# EAGLE design ME433-hw6-schematic (EAGLE 9.6.2)
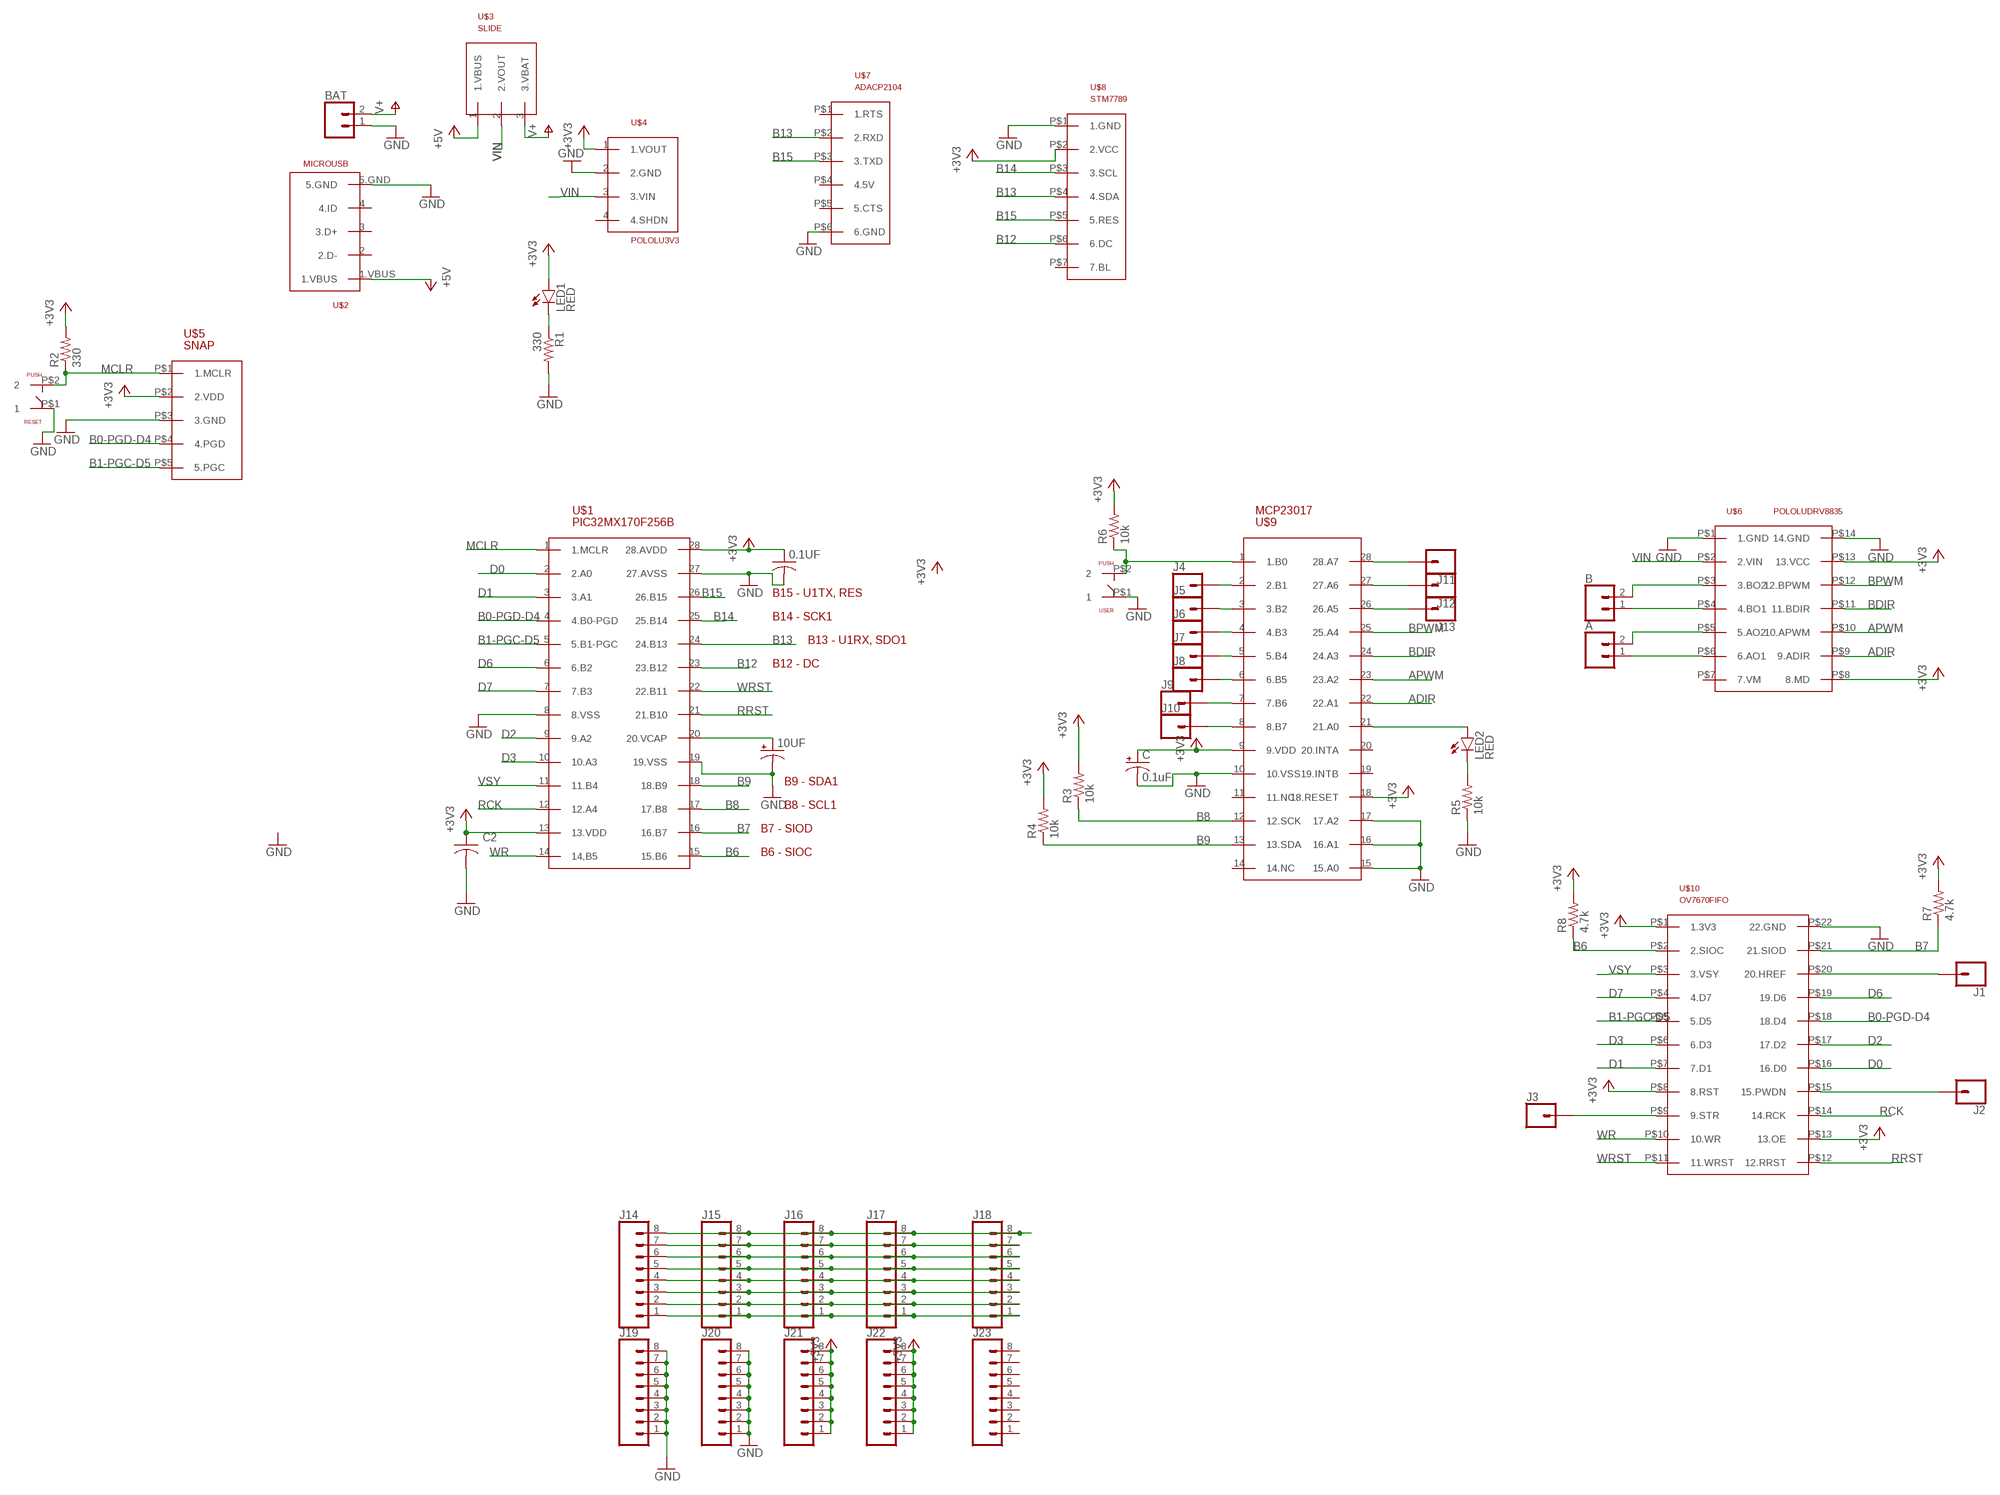
[diagram p0: schematic, sheet 1]

## Parts
0.1UF  C-US025-030X050  [C025-030X050]
10UF  CPOL-USB45181B  [B45181B]
A  CONN_02  [1X02]
B  CONN_02  [1X02]
BAT  CONN_02  [1X02]
C  0.1uF  CPOL-USB45181B  [B45181B]
C2  C-US025-030X050  [C025-030X050]
J1  CONN_01  [1X01]
J2  CONN_01  [1X01]
J3  CONN_01  [1X01]
J4  CONN_01  [1X01]
J5  CONN_01  [1X01]
J6  CONN_01  [1X01]
J7  CONN_01  [1X01]
J8  CONN_01  [1X01]
J9  CONN_01  [1X01]
J10  CONN_01  [1X01]
J11  CONN_01  [1X01]
J12  CONN_01  [1X01]
J13  CONN_01  [1X01]
J14  CONN_08"  [1X08]
J15  CONN_08"  [1X08]
J16  CONN_08"  [1X08]
J17  CONN_08"  [1X08]
J18  CONN_08"  [1X08]
J19  CONN_08"  [1X08]
J20  CONN_08"  [1X08]
J21  CONN_08"  [1X08]
J22  CONN_08"  [1X08]
J23  CONN_08"  [1X08]
LED1  RED  LED3MM  [LED3MM]
LED2  RED  LED3MM  [LED3MM]
R1  330  R-US_0207/10  [0207/10]
R2  330  R-US_0207/10  [0207/10]
R3  10k  R-US_0207/10  [0207/10]
R4  10k  R-US_0207/10  [0207/10]
R5  10k  R-US_0207/10  [0207/10]
R6  10k  R-US_0207/10  [0207/10]
R7  4.7k  R-US_0207/10  [0207/10]
R8  4.7k  R-US_0207/10  [0207/10]
RESET  PUSH  [PUSH]
U$1  PIC32MX170F256B  [DIL28-3]
U$2  MICROUSB  [MICROUSB]
U$3  SLIDE  [SLIDE]
U$4  POLOLU3V3  [POLOLU3V3]
U$5  SNAP  [SNAP]
U$6  POLOLUDRV8835  [POLOLUDRV8835]
U$7  ADACP2104  [ADACP2104]
U$8  STM7789  [STM7789]
U$9  MCP23017  [MCP23017]
U$10  OV7670FIFO  [OV7670FIFO]
USER  PUSH  [PUSH]

## Nets
+3V3: 0.1UF.1 C2.1 C.+ J21.1 J21.2 J21.3 J21.4 J21.5 J21.6 J21.7 J21.8 J22.1 J22.2 J22.3 J22.4 J22.5 J22.6 J22.7 J22.8 LED1.A R2.2 R3.2 R4.2 R6.2 R7.2 R8.2 U$1.13(13.VDD) U$1.28(28.AVDD) U$4.1(1.VOUT) U$5.P$2(2.VDD) U$6.P$8(8.MD) U$6.P$13(13.VCC) U$8.P$2(2.VCC) U$9.9(9.VDD) U$9.18(18.RESET) U$10.P$1(1.3V3) U$10.P$8(8.RST) U$10.P$13(13.OE)
+5V: U$2.1.VBUS U$3.1(1.VBUS)
ADIR: U$6.P$9(9.ADIR) U$9.22(22.A1)
APWM: U$6.P$10(10.APWM) U$9.23(23.A2)
B0-PGD-D4: U$1.4(4.B0-PGD) U$5.P$4(4.PGD) U$10.P$18(18.D4)
B1-PGC-D5: U$1.5(5.B1-PGC) U$5.P$5(5.PGC) U$10.P$5(5.D5)
B6: R8.1 U$1.15(15.B6) U$10.P$2(2.SIOC)
B7: R7.1 U$1.16(16.B7) U$10.P$21(21.SIOD)
B8: R3.1 U$1.17(17.B8) U$9.12(12.SCK)
B9: R4.1 U$1.18(18.B9) U$9.13(13.SDA)
B12: U$1.23(23.B12) U$8.P$6(6.DC)
B13: U$1.24(24.B13) U$7.P$2(2.RXD) U$8.P$4(4.SDA)
B14: U$1.25(25.B14) U$8.P$3(3.SCL)
B15: U$1.26(26.B15) U$7.P$3(3.TXD) U$8.P$5(5.RES)
BDIR: U$6.P$11(11.BDIR) U$9.24(24.A3)
BPWM: U$6.P$12(12.BPWM) U$9.25(25.A4)
D0: U$1.2(2.A0) U$10.P$16(16.D0)
D1: U$1.3(3.A1) U$10.P$7(7.D1)
D2: U$1.9(9.A2) U$10.P$17(17.D2)
D3: U$1.10(10.A3) U$10.P$6(6.D3)
D6: U$1.6(6.B2) U$10.P$19(19.D6)
D7: U$1.7(7.B3) U$10.P$4(4.D7)
GND: 0.1UF.2 10UF.- BAT.1 C2.2 C.- J19.1 J19.2 J19.3 J19.4 J19.5 J19.6 J19.7 J19.8 J20.1 J20.2 J20.3 J20.4 J20.5 J20.6 J20.7 J20.8 R1.2 R5.1 RESET.P$1 U$1.8(8.VSS) U$1.19(19.VSS) U$1.27(27.AVSS) U$2.5.GND U$4.2(2.GND) U$5.P$3(3.GND) U$6.P$1(1.GND) U$6.P$14(14.GND) U$7.P$6(6.GND) U$8.P$1(1.GND) U$9.10(10.VSS) U$9.15(15.A0) U$9.16(16.A1) U$9.17(17.A2) U$10.P$22(22.GND) USER.P$1
MCLR: R2.1 RESET.P$2 U$1.1(1.MCLR) U$5.P$1(1.MCLR)
N$1: LED1.K(C) R1.1
N$2: LED2.K(C) R5.2
N$3: B.2 U$6.P$3(3.BO2)
N$4: 10UF.+ U$1.20(20.VCAP)
N$5: LED2.A U$9.21(21.A0)
N$6: R6.1 U$9.1(1.B0) USER.P$2
N$7: B.1 U$6.P$4(4.BO1)
N$8: A.2 U$6.P$5(5.AO2)
N$9: A.1 U$6.P$6(6.AO1)
N$10: J3.1 U$10.P$9(9.STR)
N$11: J2.1 U$10.P$15(15.PWDN)
N$12: J1.1 U$10.P$20(20.HREF)
N$13: J4.1 U$9.2(2.B1)
N$14: J5.1 U$9.3(3.B2)
N$15: J6.1 U$9.4(4.B3)
N$16: J7.1 U$9.5(5.B4)
N$17: J8.1 U$9.6(6.B5)
N$18: J9.1 U$9.7(7.B6)
N$19: J10.1 U$9.8(8.B7)
N$20: J11.1 U$9.28(28.A7)
N$21: J12.1 U$9.27(27.A6)
N$22: J13.1 U$9.26(26.A5)
N$23: J14.8 J15.8 J16.8 J17.8 J18.8
N$24: J14.7 J15.7 J16.7 J17.7 J18.7
N$25: J14.6 J15.6 J16.6 J17.6 J18.6
N$26: J14.5 J15.5 J16.5 J17.5 J18.5
N$27: J14.4 J15.4 J16.4 J17.4 J18.4
N$28: J14.3 J15.3 J16.3 J17.3 J18.3
N$29: J14.2 J15.2 J16.2 J17.2 J18.2
N$30: J14.1 J15.1 J16.1 J17.1 J18.1
RCK: U$1.12(12.A4) U$10.P$14(14.RCK)
RRST: U$1.21(21.B10) U$10.P$12(12.RRST)
V+: BAT.2 U$3.3(3.VBAT)
VIN: U$3.2(2.VOUT) U$4.3(3.VIN) U$6.P$2(2.VIN)
VSY: U$1.11(11.B4) U$10.P$3(3.VSY)
WR: U$1.14(14,B5) U$10.P$10(10.WR)
WRST: U$1.22(22.B11) U$10.P$11(11.WRST)
Unconnected: J23.1 J23.2 J23.3 J23.4 J23.5 J23.6 J23.7 J23.8 U$2.2(2.D-) U$2.3(3.D+) U$2.4(4.ID) U$4.4(4.SHDN) U$6.P$7(7.VM) U$7.P$1(1.RTS) U$7.P$4(4.5V) U$7.P$5(5.CTS) U$8.P$7(7.BL) U$9.11(11.NC) U$9.14(14.NC) U$9.19(19.INTB) U$9.20(20.INTA)

## Notes on the sheet
- B15 - U1TX, RES
- B14 - SCK1
- B13 - U1RX, SDO1
- B12 - DC
- B9 - SDA1
- B8 - SCL1
- B7 - SIOD
- B6 - SIOC

## Library data of the parts
0.1UF C2 = ME433-PCB-Library:C-US: CAPACITOR, American symbol; SPICEPREFIX: C
10UF C = ME433-PCB-Library:CPOL-US: POLARIZED CAPACITOR, American symbol; SPICEPREFIX: C
A B BAT = ME433-PCB-Library:CONN_02: Multi connection point. Often used as Generic Header-pin footprint for 0.1 inch spaced/style header connections On any of the 0.1 inch spaced packages, you can populate with these: Break Away Headers - Straight <https://www.sparkfun.com/products/116> (PRT-00116) Break Away Male Headers - Right Angle <https://www.sparkfun.com/products/553> (PRT-00553) Female Headers <https://www.sparkfun.com/products/115> (PRT-00115) Break Away Headers - Machine Pin <https://www.sparkfun.com/products/117> (PRT-00117) Break Away Female Headers - Swiss Machine Pin <https://www.sparkfun.com/products/743> (PRT-00743) For SCREWTERMINALS and SPRING TERMINALS visit here: Screw Terimnals on SparkFun.com <https://www.sparkfun.com/search/results?term=Screw+Terminals> (5mm/3.5mm/2.54mm spacing) This device is also useful as a general connection point to wire up your design to another part of your project. Our various solder wires solder well into these plated through hole pads. Hook-Up Wire - Assortment (Stranded, 22 AWG) <https://www.sparkfun.com/products/11375> (PRT-11375) Hook-Up Wire - Assortment (Solid Core, 22 AWG) <https://www.sparkfun.com/products/11367> (PRT-11367) View the entire wire category on our website here <https://www.sparkfun.com/categories/141> Special notes: Molex polarized connector foot print use with: PRT-08233 with associated crimp pins and housings. 2.54_SCREWTERM for use with PRT-10571. 3.5mm Screw Terminal footprints for PRT-08084 5mm Screw Terminal footprints for use with PRT-08432
J1-J13 = ME433-PCB-Library:CONN_01: Single connection point. Often used as Generic Header-pin footprint for 0.1 inch spaced/style header connections On any of the 0.1 inch spaced packages, you can populate with these: Break Away Headers - Straight <https://www.sparkfun.com/products/116> (PRT-00116) Break Away Male Headers - Right Angle <https://www.sparkfun.com/products/553> (PRT-00553) Female Headers <https://www.sparkfun.com/products/115> (PRT-00115) Break Away Headers - Machine Pin <https://www.sparkfun.com/products/117> (PRT-00117) Break Away Female Headers - Swiss Machine Pin <https://www.sparkfun.com/products/743> (PRT-00743) This device is also useful as a general connection point to wire up your design to another part of your project. Our various solder wires solder well into these plated through hole pads. Hook-Up Wire - Assortment (Stranded, 22 AWG) <https://www.sparkfun.com/products/11375> (PRT-11375) Hook-Up Wire - Assortment (Solid Core, 22 AWG) <https://www.sparkfun.com/products/11367> (PRT-11367) View the entire wire category on our website here <https://www.sparkfun.com/categories/141> Special notes: SMTSO-256-ET is a "flush mount" nut for a 4-40 screw. We mostly use this on specialty testbeds; it is a nice way to connect hardware to your PCB at an adjustable hieght. Also note, the SNAP packages are for using a snappable style connector. We sell a baggie of snaps and they are also used on two LilyPad designs: Snap Assortment - 30 pack (male and female) <https://www.sparkfun.com/products/11347> (DEV-11347) LilyPad Arduino SimpleSnap <https://www.sparkfun.com/products/10941> (DEV-10941) LilyPad SimpleSnap Protoboard <https://www.sparkfun.com/products/10940> (DEV-10940)
J14-J23 = ME433-PCB-Library:CONN_08: Multi connection point. Often used as Generic Header-pin footprint for 0.1 inch spaced/style header connections On any of the 0.1 inch spaced packages, you can populate with these: Break Away Headers - Straight <https://www.sparkfun.com/products/116> (PRT-00116) Break Away Male Headers - Right Angle <https://www.sparkfun.com/products/553> (PRT-00553) Female Headers <https://www.sparkfun.com/products/115> (PRT-00115) Break Away Headers - Machine Pin <https://www.sparkfun.com/products/117> (PRT-00117) Break Away Female Headers - Swiss Machine Pin <https://www.sparkfun.com/products/743> (PRT-00743) Arduino Stackable Header - 8 Pin <https://www.sparkfun.com/products/9279> (PRT-09279) For SCREWTERMINALS and SPRING TERMINALS visit here: Screw Terimnals on SparkFun.com <https://www.sparkfun.com/search/results?term=Screw+Terminals> (5mm/3.5mm/2.54mm spacing) This device is also useful as a general connection point to wire up your design to another part of your project. Our various solder wires solder well into these plated through hole pads. Hook-Up Wire - Assortment (Stranded, 22 AWG) <https://www.sparkfun.com/products/11375> (PRT-11375) Hook-Up Wire - Assortment (Solid Core, 22 AWG) <https://www.sparkfun.com/products/11367> (PRT-11367) View the entire wire category on our website here <https://www.sparkfun.com/categories/141> Special notes: Molex polarized connector foot print use with SKU : PRT-08231 with associated crimp pins and housings. 1MM SMD Version SKU: PRT-10208 NOTES ON THE VARIANTS LOCK and LOCK_LONGPADS... This footprint was designed to help hold the alignment of a through-hole component (i.e. 6-pin header) while soldering it into place. You may notice that each hole has been shifted either up or down by 0.005 of an inch from it's more standard position (which is a perfectly straight line). This slight alteration caused the pins (the squares in the middle) to touch the edges of the holes. Because they are alternating, it causes a "brace" to hold the component in place. 0.005 has proven to be the perfect amount of "off-center" position when using our standard breakaway headers. Although looks a little odd when you look at the bare footprint, once you have a header in there, the alteration is very hard to notice. Also,if you push a header all the way into place, it is covered up entirely on the bottom side.; PROD_ID: CONN-08438
LED1 LED2 = ME433-PCB-Library:LED: LED OSRAM: - CHIPLED LG R971, LG N971, LY N971, LG Q971, LY Q971, LO R971, LY R971 LH N974, LH R974 LS Q976, LO Q976, LY Q976 LO Q996 - Hyper CHIPLED LW Q18S LB Q993, LB Q99A, LB R99A - SideLED LS A670, LO A670, LY A670, LG A670, LP A670 LB A673, LV A673, LT A673, LW A673 LH A674 LY A675 LS A676, LA A676, LO A676, LY A676, LW A676 LS A679, LY A679, LG A679 - Hyper Micro SIDELED® LS Y876, LA Y876, LO Y876, LY Y876 LT Y87S - SmartLED LW L88C, LW L88S LB L89C, LB L89S, LG L890 LS L89K, LO L89K, LY L89K LS L896, LA L896, LO L896, LY L896 - TOPLED LS T670, LO T670, LY T670, LG T670, LP T670 LSG T670, LSP T670, LSY T670, LOP T670, LYG T670 LG T671, LOG T671, LSG T671 LB T673, LV T673, LT T673, LW T673 LH T674 LS T676, LA T676, LO T676, LY T676, LB T676, LH T676, LSB T676, LW T676 LB T67C, LV T67C, LT T67C, LS T67K, LO T67K, LY T67K, LW E67C LS E67B, LA E67B, LO E67B, LY E67B, LB E67C, LV E67C, LT E67C LW T67C LS T679, LY T679, LG T679 LS T770, LO T770, LY T770, LG T770, LP T770 LB T773, LV T773, LT T773, LW T773 LH T774 LS E675, LA E675, LY E675, LS T675 LS T776, LA T776, LO T776, LY T776, LB T776 LHGB T686 LT T68C, LB T68C - Hyper Mini TOPLED® LB M676 - Mini TOPLED Santana® LG M470 LS M47K, LO M47K, LY M47K Source: http://www.osram.convergy.de LUXEON: - LUMILED® LXK2-PW12-R00, LXK2-PW12-S00, LXK2-PW14-U00, LXK2-PW14-V00 LXK2-PM12-R00, LXK2-PM12-S00, LXK2-PM14-U00 LXK2-PE12-Q00, LXK2-PE12-R00, LXK2-PE12-S00, LXK2-PE14-T00, LXK2-PE14-U00 LXK2-PB12-K00, LXK2-PB12-L00, LXK2-PB12-M00, LXK2-PB14-N00, LXK2-PB14-P00, LXK2-PB14-Q00 LXK2-PR12-L00, LXK2-PR12-M00, LXK2-PR14-Q00, LXK2-PR14-R00 LXK2-PD12-Q00, LXK2-PD12-R00, LXK2-PD12-S00 LXK2-PH12-R00, LXK2-PH12-S00 LXK2-PL12-P00, LXK2-PL12-Q00, LXK2-PL12-R00 Source: www.luxeon.com KINGBRIGHT: KA-3528ASYC Source: www.kingbright.com
R1-R8 = ME433-PCB-Library:R-US_: RESISTOR, American symbol; SPICEPREFIX: R
RESET USER = ME433-PCB-Library:PUSH
U$1 = ME433-PCB-Library:PIC32MX170F256B
U$2 = ME433-PCB-Library:MICROUSB
U$3 = ME433-PCB-Library:SLIDE
U$4 = ME433-PCB-Library:POLOLU3V3
U$5 = ME433-PCB-Library:SNAP
U$6 = ME433-PCB-Library:POLOLUDRV8835
U$7 = ME433-PCB-Library:ADACP2104
U$8 = ME433-PCB-Library:STM7789
U$9 = ME433-PCB-Library:MCP23017
U$10 = ME433-PCB-Library:OV7670FIFO

## Board
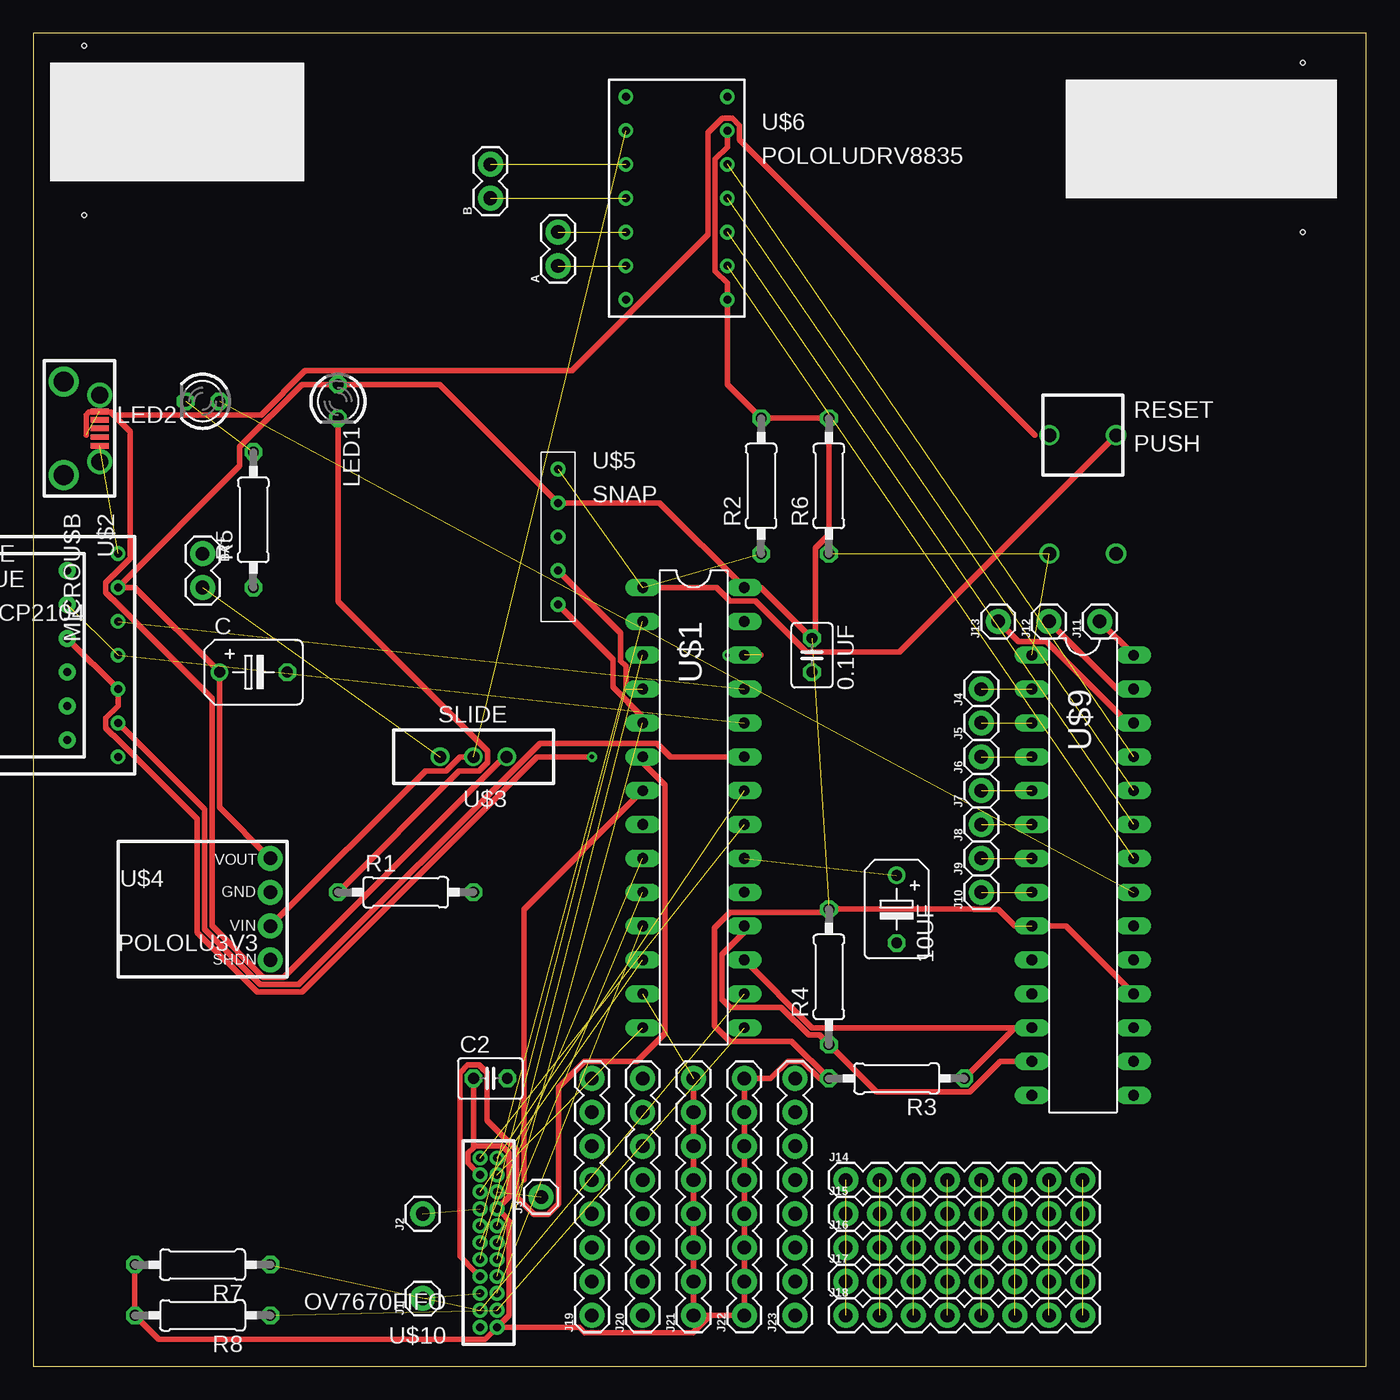
[diagram p1: board, top side]
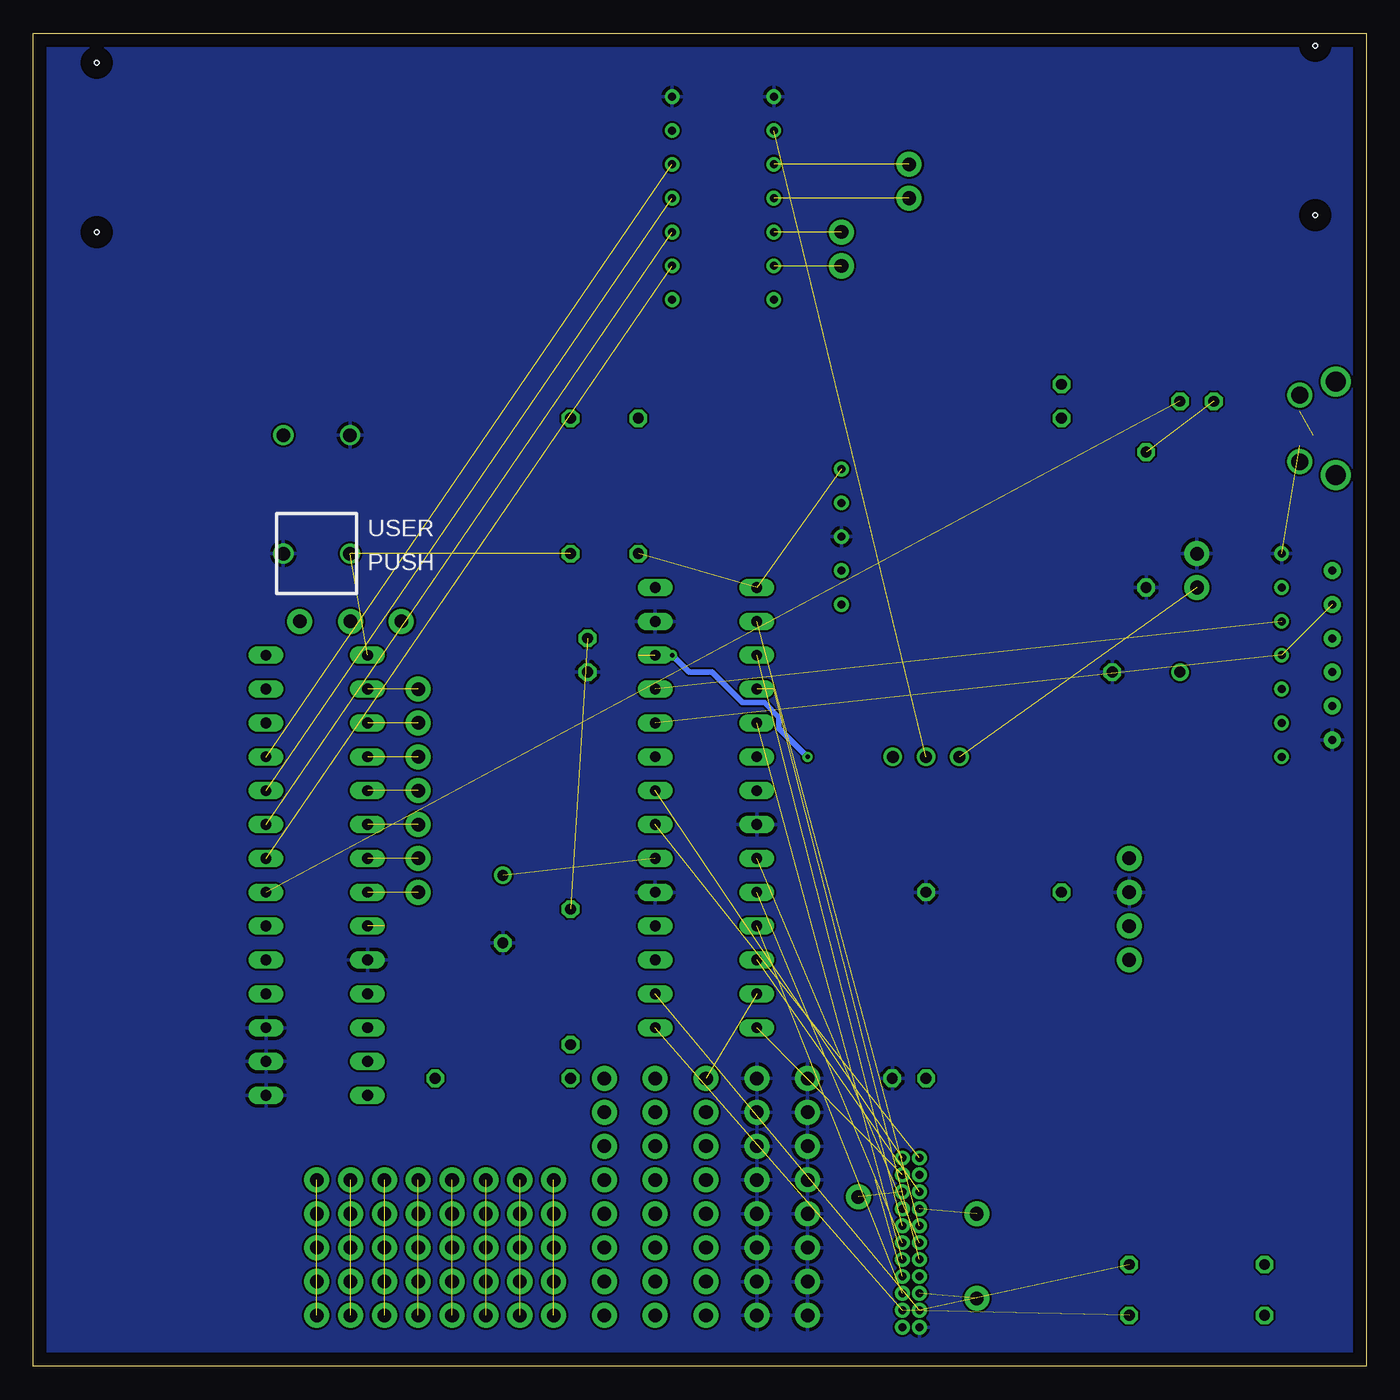
[diagram p2: board, bottom side, seen from below]

Size 100 x 100 mm. Coordinates in mm from the lower left corner, seen from the top.
Outline: 0,0 100,0 100,100 0,100 0,0
Copper layers (1*16): Top 0.035mm / dielectric 1.5mm / Bottom 0.035mm
Design rules "default": minimum track width 6mil, minimum drill 0.35mm, track to track 6mil, track to pad 6mil, pad to pad 6mil, via to via 6mil, smd to smd 6mil, copper to edge 40mil, drill to drill 6mil, minimum pad ring 10mil, minimum via ring 8mil, stop-mask expansion 4mil, vias tented up to drill 0mil, thermal gap 10mil
Holes 0.35 mm at 3.81,86.36 3.81,99.06 95.25,97.79 95.25,85.09

### Footprints (pad centres in the part's own frame; a part is rotated, then mirrored left to right if it is on the bottom)
C025-030X050 = drill 0.813 octagon: 1 -1.27,0; 2 1.27,0
B45181B = drill 0.813: + -2.54,0 | drill 0.813 octagon: - 2.54,0
1X02 = drill 1.016 pad 1.88: 1 0,0; 2 2.54,0
1X01 = drill 1.016 pad 1.88: 1 0,0
1X08 = drill 1.016 pad 1.88: 1 0,0; 2 2.54,0; 3 5.08,0; 4 7.62,0; 5 10.16,0; 6 12.7,0; 7 15.24,0; 8 17.78,0
LED3MM = drill 0.813 octagon: A -1.27,0; K 1.27,0
0207/10 = drill 0.813 octagon: 1 -5.08,0; 2 5.08,0
PUSH = drill 1: P$1 -2.5,0; P$2 2.5,0
DIL28-3 = drill 0.813 long: 1 -16.51,-3.81; 2 -13.97,-3.81; 3 -11.43,-3.81; 4 -8.89,-3.81; 5 -6.35,-3.81; 6 -3.81,-3.81; 7 -1.27,-3.81; 8 1.27,-3.81; 9 3.81,-3.81; 10 6.35,-3.81; 11 8.89,-3.81; 12 11.43,-3.81; 13 13.97,-3.81; 14 16.51,-3.81; 15 16.51,3.81; 16 13.97,3.81; 17 11.43,3.81; 18 8.89,3.81; 19 6.35,3.81; 20 3.81,3.81; 21 1.27,3.81; 22 -1.27,3.81; 23 -3.81,3.81; 24 -6.35,3.81; 25 -8.89,3.81; 26 -11.43,3.81; 27 -13.97,3.81; 28 -16.51,3.81
MICROUSB = smd 0.4 x 1.35: 1.VBUS -1.3,2.7; 2 -0.65,2.7; 3 0,2.7; 4 0.65,2.7; 5.GND 1.3,2.7 | drill 1.25 pad 1.676: P$6 -2.5,2.7; P$7 2.5,2.7 | drill 1.5: P$8 -3.5,0; P$9 3.5,0
SLIDE = drill 0.9: 1 -2.5,0; 2 0,0; 3 2.5,0
POLOLU3V3 = drill 1.016 pad 1.88: 1 0,3.81; 2 0,1.27; 3 0,-1.27; 4 0,-3.81
SNAP = drill 0.6: P$1 0,5.08; P$2 0,2.54; P$3 0,0; P$4 0,-2.54; P$5 0,-5.08
POLOLUDRV8835 = drill 0.6 pad 1.016: P$1 -3.81,6.35; P$2 -3.81,3.81; P$3 -3.81,1.27; P$4 -3.81,-1.27; P$5 -3.81,-3.81; P$6 -3.81,-6.35; P$7 -3.81,-8.89; P$8 3.81,-8.89; P$9 3.81,-6.35; P$10 3.81,-3.81; P$11 3.81,-1.27; P$12 3.81,1.27; P$13 3.81,3.81; P$14 3.81,6.35
ADACP2104 = drill 0.6 pad 1.27: P$1 2.54,6.35; P$2 2.54,3.81; P$3 2.54,1.27; P$4 2.54,-1.27; P$5 2.54,-3.81; P$6 2.54,-6.35
STM7789 = drill 0.6: P$1 2.54,7.62; P$2 2.54,5.08; P$3 2.54,2.54; P$4 2.54,0; P$5 2.54,-2.54; P$6 2.54,-5.08; P$7 2.54,-7.62
MCP23017 = drill 0.813 long: 1 -16.51,-3.81; 2 -13.97,-3.81; 3 -11.43,-3.81; 4 -8.89,-3.81; 5 -6.35,-3.81; 6 -3.81,-3.81; 7 -1.27,-3.81; 8 1.27,-3.81; 9 3.81,-3.81; 10 6.35,-3.81; 11 8.89,-3.81; 12 11.43,-3.81; 13 13.97,-3.81; 14 16.51,-3.81; 15 16.51,3.81; 16 13.97,3.81; 17 11.43,3.81; 18 8.89,3.81; 19 6.35,3.81; 20 3.81,3.81; 21 1.27,3.81; 22 -1.27,3.81; 23 -3.81,3.81; 24 -6.35,3.81; 25 -8.89,3.81; 26 -11.43,3.81; 27 -13.97,3.81; 28 -16.51,3.81
OV7670FIFO = drill 0.6: P$1 -1.27,7.62; P$2 -1.27,6.35; P$3 -1.27,5.08; P$4 -1.27,3.81; P$5 -1.27,2.54; P$6 -1.27,1.27; P$7 -1.27,0; P$8 -1.27,-1.27; P$9 -1.27,-2.54; P$10 -1.27,-3.81; P$11 -1.27,-5.08; P$12 0,-5.08; P$13 0,-3.81; P$14 0,-2.54; P$15 0,-1.27; P$16 0,0; P$17 0,1.27; P$18 0,2.54; P$19 0,3.81; P$20 0,5.08; P$21 0,6.35; P$22 0,7.62

### Placement (x,y rotation side)
0.1UF  58.42,53.34 270 top
10UF  64.77,34.29 270 top
A  39.37,82.55 90 top
B  34.29,87.63 90 top
BAT  12.7,60.96 270 top
C  16.51,52.07 0 top
C2  34.29,21.59 0 top
J1  29.21,5.08 90 top
J2  29.21,11.43 90 top
J3  38.1,12.7 90 top
J4  71.12,50.8 90 top
J5  71.12,48.26 90 top
J6  71.12,45.72 90 top
J7  71.12,43.18 90 top
J8  71.12,40.64 90 top
J9  71.12,38.1 90 top
J10  71.12,35.56 90 top
J11  80.01,55.88 90 top
J12  76.2,55.88 90 top
J13  72.39,55.88 90 top
J14  60.96,13.97 0 top
J15  60.96,11.43 0 top
J16  60.96,8.89 0 top
J17  60.96,6.35 0 top
J18  60.96,3.81 0 top
J19  41.91,3.81 90 top
J20  45.72,3.81 90 top
J21  49.53,3.81 90 top
J22  53.34,3.81 90 top
J23  57.15,3.81 90 top
LED1  22.86,72.39 270 top
LED2  12.7,72.39 180 top
R1  27.94,35.56 0 top
R2  54.61,66.04 90 top
R3  64.77,21.59 180 top
R4  59.69,29.21 90 top
R5  16.51,63.5 90 top
R6  59.69,66.04 90 top
R7  12.7,7.62 180 top
R8  12.7,3.81 180 top
RESET  78.74,69.85 0 top
U$1  49.53,41.91 270 top
U$2  2.29,70.36 270 top
U$3  33.02,45.72 180 top
U$4  17.78,34.29 0 top
U$5  39.37,62.23 0 top
U$6  48.26,88.9 0 top
U$7  0,53.34 0 top
U$8  3.81,53.34 0 top
U$9  78.74,36.83 270 top
U$10  33.53,10.54 180 top
USER  78.74,60.96 0 bottom

### Tracks (layer width: path | path; a pad name or v marks a point on that pad's centre or on a via)
+3V3  (3 unrouted)
  Top 0.406: U$4.1 13.97,41.91 C.+ 7.62,58.42 U$8.P$2 15.49,67.56 15.49,69 20.15,73.66 LED1.A 30.48,73.66 U$5.P$2 46.99,64.77 U$1.28 54.61,58.42 0.1UF.1 58.67,54.86 58.67,61.38 59.69,62.4 R6.2 R2.2 52.07,73.66 U$6.P$8 52.07,81.26 51.16,82.17 51.16,90.55 52.07,91.46 U$6.P$13 | J21.8 J21.7 J21.6 J21.5 J21.4 J21.3 J21.2 J21.1 50.8,3.81 | 50.8,3.81 J22.1 J22.2 J22.3 J22.4 J22.5 J22.6 J22.7 J22.8 55.32,21.59 56.61,22.89 57.69,22.89 58.98,21.59 R3.2 56.9,24.38 52.26,24.38 51.1,25.54 51.1,32.88 52.26,34.04 59.44,34.04 R4.2 70.56,34.29 70.58,34.27 72.42,34.27 73.66,33.02 | U$9.9 77.47,33.02 U$9.18 | C2.1 33.02,16.4 | 33.02,16.4 32.62,16 32.62,15.24 33.15,14.71 33.17,14.71 U$10.P$13 | 33.02,16.4 33.15,16.53 35.17,16.53 35.71,16 35.71,12.7 35.17,12.17 35.16,12.17 U$10.P$8 35.16,11.45 35.17,11.45 35.71,10.92 35.71,3.81 35.17,3.28 35.16,3.28 U$10.P$1 34.81,2.92 | 34.81,2.92 40.97,2.92 41.37,2.52 49.51,2.52 50.8,3.81 | R7.2 R8.2 9.42,2.01 33.91,2.01 34.81,2.92
+5V  (1 unrouted)
  Top 0.406: U$3.1 35.31,45.72 18.77,29.18 17.24,29.18 13.41,33.02 13.41,50.1 6.01,57.51 5.97,57.51 5.44,58.04 5.44,58.8 5.97,59.33 6.01,59.33 7.26,60.58 7.26,70.11 5.81,71.56 4.17,71.56 4.16,71.56 | 4.16,71.56 3.96,71.36 3.96,69.85 | 4.16,71.56 5.81,71.56 6,71.37 17.08,71.37 20.38,74.68 40.4,74.68 50.6,84.88 50.6,92.53 51.69,93.62 52.45,93.62 52.98,93.09 52.98,92 75.13,69.85
ADIR  (1 unrouted)
APWM  (1 unrouted)
B0-PGD-D4  (2 unrouted)
  Top 0.406: 44.45,50.8 44.45,52.51 44.04,52.92 44.04,55.02 U$5.P$4
B1-PGC-D5  (1 unrouted)
  Top 0.406: U$5.P$5 43.48,53.03 43.48,50.94 45.72,48.7 U$1.5
B6  (2 unrouted)
B7  (2 unrouted)
B8
  Top 0.406: R3.1 73.66,25.4 U$9.12 58.42,25.4 U$1.17
B9
  Top 0.406: U$1.18 53.34,32.58 51.66,30.9 51.66,27.52 52.26,26.92 56.11,26.92 58.19,24.84 58.98,24.84 R4.1 63.25,20.57 70.27,20.57 72.56,22.86 U$9.13
B12
  Top 0.406: U$1.23 47.82,45.72 46.8,46.74 38.03,46.74 19.92,28.63 17.01,28.63 12.85,32.78 12.85,41.76 U$8.P$6
B13  (2 unrouted)
B14  (1 unrouted)
B15  (via drill 0.35)  (1 unrouted)
  Top 0.406: U$7.P$3 U$8.P$5 6.35,49.55 5.44,48.64 5.44,47.88 5.97,47.35 6.01,47.35 12.29,41.06 12.29,32.55 16.78,28.07 20.16,28.07 37.81,45.72 v41.91,45.72 | v52.07,53.34 54.61,53.34
  Bottom 0.406: v41.91,45.72 44.04,47.85 44.04,48.68 45.15,49.78 46.8,49.78 49.09,52.07 50.8,52.07 v52.07,53.34
BDIR  (1 unrouted)
BPWM  (1 unrouted)
D0  (1 unrouted)
D1  (1 unrouted)
D2  (1 unrouted)
D3  (1 unrouted)
D6
  Top 0.406: U$1.6 45.72,45.28 47.4,43.6 47.4,24.98 45.3,22.89 41.37,22.89 39.4,20.91 39.4,12.16 38.64,11.4 37.56,11.4 36.27,12.7 36.27,16.23 34.04,18.46 34.04,22.01 33.44,22.61 32.6,22.61 32,22.01 32,8.24 33.15,7.09 33.17,7.09 U$10.P$19
D7  (1 unrouted)
  Top 0.406: U$1.7 36.83,34.28 36.83,13.97
GND  (1 unrouted)
  pour Bottom: 0,0 100.33,0 100.33,100.33 0,100.33
MCLR  (2 unrouted)
  Top 0.406: U$1.1 51.24,58.42 52.26,57.4 54.19,57.4 58,53.59 64.98,53.59 RESET.P$2
N$1
  Top 0.406: LED1.K 22.86,57.38 34.08,46.16 34.08,45.28 33.46,44.66 31.96,44.66 R1.1
N$2  (1 unrouted)
N$3  (1 unrouted)
N$4  (1 unrouted)
N$5  (1 unrouted)
N$6  (2 unrouted)
N$7  (1 unrouted)
N$8  (1 unrouted)
N$9  (1 unrouted)
N$10  (1 unrouted)
N$11  (1 unrouted)
N$12  (1 unrouted)
N$13  (1 unrouted)
N$14  (1 unrouted)
N$15  (1 unrouted)
N$16  (1 unrouted)
N$17  (1 unrouted)
N$18  (1 unrouted)
N$19  (1 unrouted)
N$20
  Top 0.406: J11.1 U$9.28
N$21
  Top 0.406: J12.1 81.28,50.8 U$9.27
N$22
  Top 0.406: J13.1 73.91,54.36 76.01,54.36 82.11,48.26 U$9.26
N$23  (4 unrouted)
N$24  (4 unrouted)
N$25  (4 unrouted)
N$26  (4 unrouted)
N$27  (4 unrouted)
N$28  (4 unrouted)
N$29  (4 unrouted)
N$30  (4 unrouted)
RCK  (1 unrouted)
RRST  (1 unrouted)
V+  (1 unrouted)
VIN  (1 unrouted)
  Top 0.406: U$4.3 29.42,44.66 30.96,44.66 32.02,45.72 U$3.2
VSY  (1 unrouted)
WR  (1 unrouted)
WRST  (1 unrouted)